# Altium schematic sheet 30A Other Pwr 2.SchDoc
size 297 x 209 mm
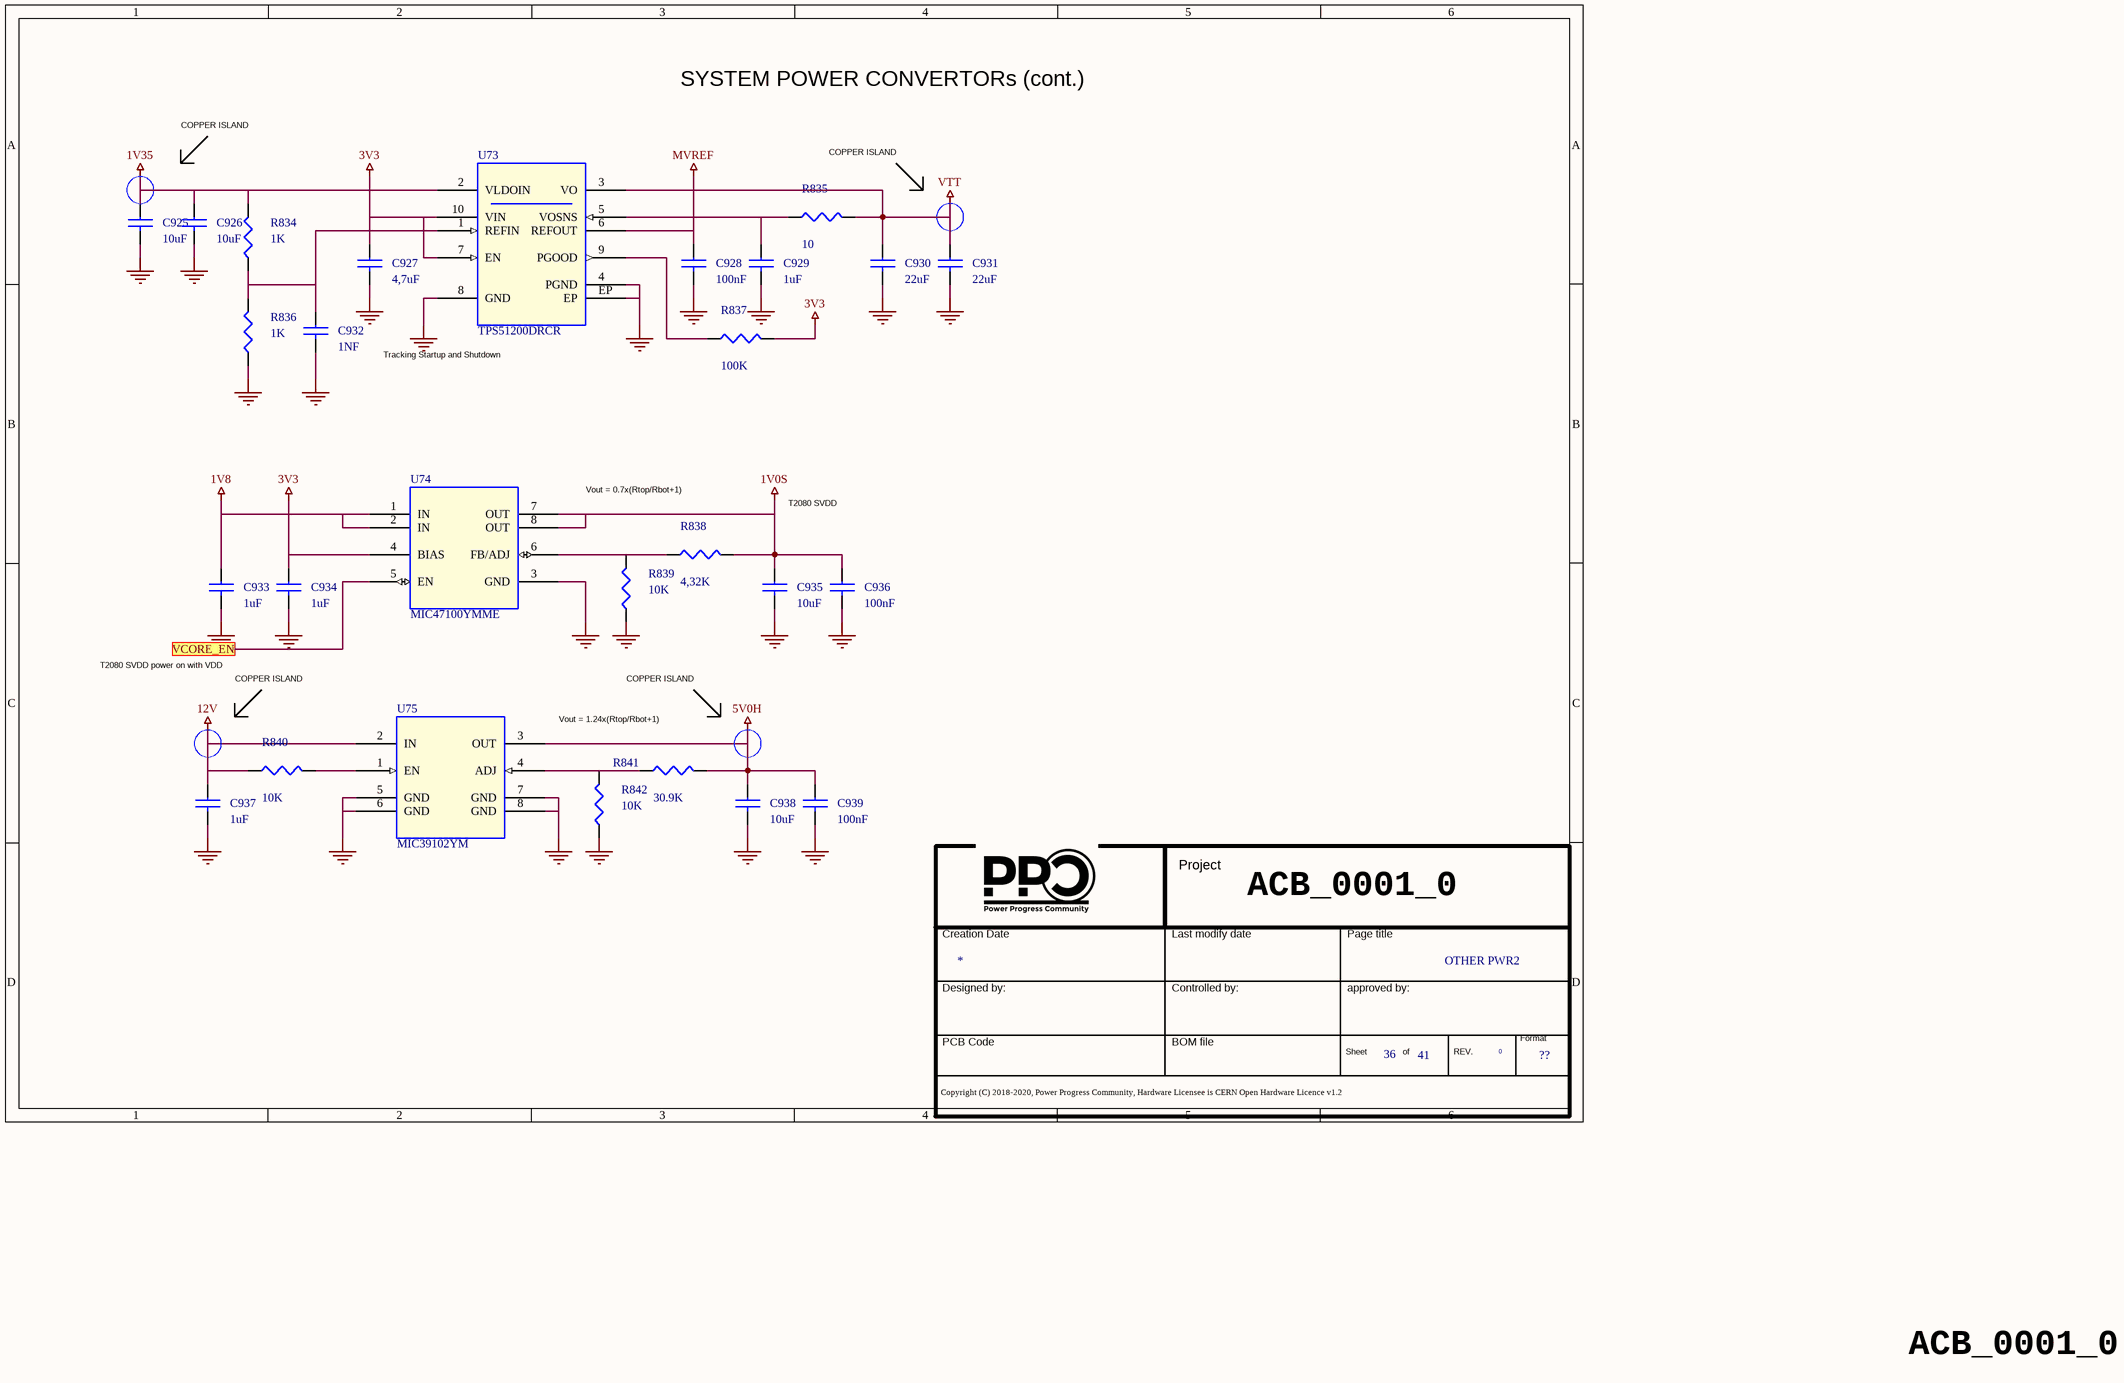
[diagram p0: 30A Other Pwr 2.SchDoc]

## Parts
*  Doc: OTHER PWR2  Page Count: 41  Page Number: 36  Page Size: ??  RevCode: 0  (hidden comment: Title_block_PPC)  (graphical)
C925  10uF  [SMD_0603]
C926  10uF  [SMD_0603]
C927  4,7uF  [SMD_0603]
C928  100nF  [SMD_0402]
C929  1uF  [SMD_0402]
C930  22uF  [SMD_0805]
C931  22uF  [SMD_0805]
C932  1NF  [SMD_0402]
C933  1uF  [SMD_0402]
C934  1uF  [SMD_0402]
C935  10uF  [SMD_0603]
C936  100nF  [SMD_0402]
C937  1uF  [SMD_0402]
C938  10uF  [SMD_0603]
C939  100nF  [SMD_0402]
R834  1K  [SMD_0402]
R835  10  [SMD_0402]
R836  1K  [SMD_0402]
R837  100K  [SMD_0402]
R838  4,32K  [SMD_0402]
R839  10K  [SMD_0402]
R840  10K  [SMD_0402]
R841  30.9K  [SMD_0402]
R842  10K  [SMD_0402]
U73  TPS51200DRCR  [QFN-10]
U74  MIC47100YMME  [msop_8]
U75  MIC39102YM  [SOIC-8]

## Ports
VCORE_EN

## Nets
1V0S: C935.1 C936.1 R838.2 U74.7(OUT) U74.8(OUT)
1V8: C933.1 U74.1(IN) U74.2(IN)
1V35: C925.1 C926.1 R834.2 U73.2(VLDOIN)
3V3: C927.1 C934.1 R837.2 U73.7(EN) U73.10(VIN) U74.4(BIAS)
5V0H: C938.1 C939.1 R841.2 U75.3(OUT)
12V: C937.1 R840.1 U75.2(IN)
GND: C925.2 C926.2 C927.2 C928.2 C929.2 C930.2 C931.2 C932.2 C933.2 C934.2 C935.2 C936.2 C937.2 C938.2 C939.2 R836.1 R839.1 R842.1 U73.4(PGND) U73.8(GND) U73.EP U74.3(GND) U75.5(GND) U75.6(GND) U75.7(GND) U75.8(GND)
MVREF: C928.1 U73.6(REFOUT)
VTT: C930.1 C931.1 R835.2 U73.3(VO)
VCORE_EN: U74.5(EN) ; port VCORE_EN
NetC929_1: C929.1 R835.1 U73.5(VOSNS)
NetC932_1: C932.1 R834.1 R836.2 U73.1(REFIN)
NetR837_1: R837.1 U73.9(PGOOD)
NetR838_1: R838.1 R839.2 U74.6(FB/ADJ)
NetR840_2: R840.2 U75.1(EN)
NetR841_1: R841.1 R842.2 U75.4(ADJ)

## Notes on the sheet
- COPPER ISLAND
- SYSTEM POWER CONVERTORs (cont.)
- Tracking Startup and Shutdown
- Vout = 0.7x(Rtop/Rbot+1)
- T2080 SVDD
- T2080 SVDD power on with VDD
- Vout = 1.24x(Rtop/Rbot+1)
- ACB_0001_0
- (in symbol Title_block_PPC) Project; Creation Date; Last modify date; Page title; Designed by:; Controlled by:; approved by:; PCB Code; BOM file; Format; Sheet; of; REV.; Copyright (C) 2018-2020, Power Progress Community, Hardware Licensee is CERN Open Hardware Licence v1.2

## Library data of the parts
* = Title_block_PPC: Title: T2080PCIe; Schematic Page Count: 45; Schematic Page Number: 40; Author: MICETEK; Page Create Date: March  8, 1995; Page Title: ?; Page Modify Date: *
C925 C926 C935 C938 = CAP NP_Dup2: COND.CER.10uF 0603 25V SMD; Part Number: PASSIVE_124; Manufacturer 1: SAMSUNG; Manufacturer Part Number 1: CL10A106MA8NRNC; RSM: RC0603; Part Type: Capacitors\Ceramic\SMD\0603; PCB Footprint: SMD_0603
C927 = CAP NP_Dup2: COND.CER.4,7uF 16V X5R 0603 SMD; Manufacturer Part Number 1: CL10A475KO8NNNC; Manufacturer 1: SAMSUNG; Part Number: PASSIVE_1405; RSM: RC0603; PCB Footprint: SMD_0603; Part Type: Capacitors\Ceramic\SMD\0603
C928 C936 = CAP NP_Dup2: COND.CER. 100NF 50V 0402 X7R SMD; Manufacturer Part Number 1: CGA2B3X7R1H104M050BD; Manufacturer 1: TDK; Part Number: PASSIVE_24; RSM: RC0402; PCB Footprint: SMD_0402; Part Type: Capacitors\Ceramic\SMD\0402
C929 C933 C934 C937 = CAP NP_Dup2: CAP CER 1UF 25V X6S 0402; Part Number: PASSIVE_1446; Manufacturer 1: Murata; Manufacturer Part Number 1: GRM155C81E105KE11D; RSM: RC0402; Part Type: Capacitors\Ceramic\SMD\0402; PCB Footprint: SMD_0402
C930 C931 = CAP NP_Dup2: 22UF 35V 20% 0805; Part Number: PASSIVE_224; Manufacturer 1: TDK; Manufacturer Part Number 1: C2012X5R1V226M125AC; RSM: RC0805; Part Type: Capacitors\Ceramic\SMD\0805; PCB Footprint: SMD_0805
C932 = CAP NP_Dup2: COND.CER. 1NF 50V 0402 X7R SMD; Manufacturer Part Number 1: GRM15XR71H102KA86D; Manufacturer 1: Murata; Part Number: PASSIVE_47; RSM: RC0402; PCB Footprint: SMD_0402; Part Type: Capacitors\Ceramic\SMD\0402
C939 = CAP NP_Dup2: COND.CER. 100NF 50V 0402 X7R SMD; Part Number: PASSIVE_24; Manufacturer 1: TDK; Manufacturer Part Number 1: CGA2B3X7R1H104M050BD; RSM: RC0402; Part Type: Capacitors\Ceramic\SMD\0402; PCB Footprint: SMD_0402
R834 R836 = R_Dup5: RESIS.CHIP 1K 1% 0402 SMD; Manufacturer 1: ROYAL OHM; Part Number: PASSIVE_628; RSM: RC0402; Manufacturer Part Number 1: RESIS.CHIP 1K 1% 0402 SMD; Part Type: Resistors\Fixed\SMD\0402\1%; PCB Footprint: SMD_0402
R835 = R_Dup5: RESIS.CHIP 10R 5% 0402 SMD; Part Number: PASSIVE_811; Manufacturer 1: ROYAL OHM; RSM: RC0402; Part Type: Resistors\Fixed\SMD\0402\5%; Manufacturer Part Number 1: RESIS.CHIP 10R 5% 0402 SMD; PCB Footprint: SMD_0402
R837 = R_Dup5: RESIS.CHIP 100K 5% 0402 SMD; Manufacturer 1: ROYAL OHM; Part Number: PASSIVE_813; RSM: RC0402; PCB Footprint: SMD_0402; Manufacturer Part Number 1: RESIS.CHIP 100K 5% 0402 SMD; Part Type: Resistors\Fixed\SMD\0402\5%
R838 = R_Dup5: RESIS.CHIP 4,32K 0402 1% SMD; Part Number: PASSIVE_716; Manufacturer 1: PANASONIC; Manufacturer Part Number 1: ERJ-2RKF4321X; RSM: RC0402; Part Type: Resistors\Fixed\SMD\0402\1%; PCB Footprint: SMD_0402
R839 R840 R842 = R_Dup5: RESIS.CHIP 10K 1% 0402 SMD; Manufacturer 1: ROYAL OHM; Part Number: PASSIVE_584; RSM: RC0402; PCB Footprint: SMD_0402; Manufacturer Part Number 1: RESIS.CHIP 10K 1% 0402 SMD; Part Type: Resistors\Fixed\SMD\0402\1%
R841 = R_Dup5: RESIS.CHIP 30.9K 1% 0402 SMD; Part Number: PASSIVE_1452; Manufacturer 1: bourns; Manufacturer Part Number 1: ERJ-1GNF3092C; RSM: RC0402; Part Type: Resistors\Fixed\SMD\0402\1%; PCB Footprint: SMD_0402
U73 = TPS51200_1: IC CONV DDR DDR2 DDR3 10SON; MPN: TPS51200DRCT; Part Number: LINEAR_222; Manufacturer 1: TEXAS; PCB Footprint: SON10; RSM: VSON-10-3_1x3_1; Vendor: TI; TYPE: IC; Part Type: Regulators\Switching; Manufacturer Part Number 1: TPS51200DRCR; Distributor 1: DIGIKEY (296-26978-1-ND)
U74 = MIC47100-MSOP8: LDO 1A High Speed, Low Vin LDO; Manufacturer 1: MICROCHIP; Part Number: LINEAR_328; MPN: MIC49150YMM; PCB Footprint: MSOP8; Vendor: Micrel; RSM: MSOP-8-EP; Distributor 1: MOUSER(998-MIC47100YMME); Manufacturer Part Number 1: MIC47100YMME; Part Type: Regulators\LDO; TYPE: IC
U75 = MIC39102-SOIC: LDO 1.0A 1.0% Fixed Voltage LDO; Part Number: LINEAR_329; Manufacturer 1: MICROCHIP; RSM: SO-8; Vendor: Micrel; PCB Footprint: SOIC8; MPN: MIC39102YM; TYPE: IC; Part Type: Regulators\LDO; Manufacturer Part Number 1: MIC39102YM; Distributor 1: MOUSER(998-MIC39102YM)